# EAGLE design efalcon_V2 (EAGLE 9.5.2)
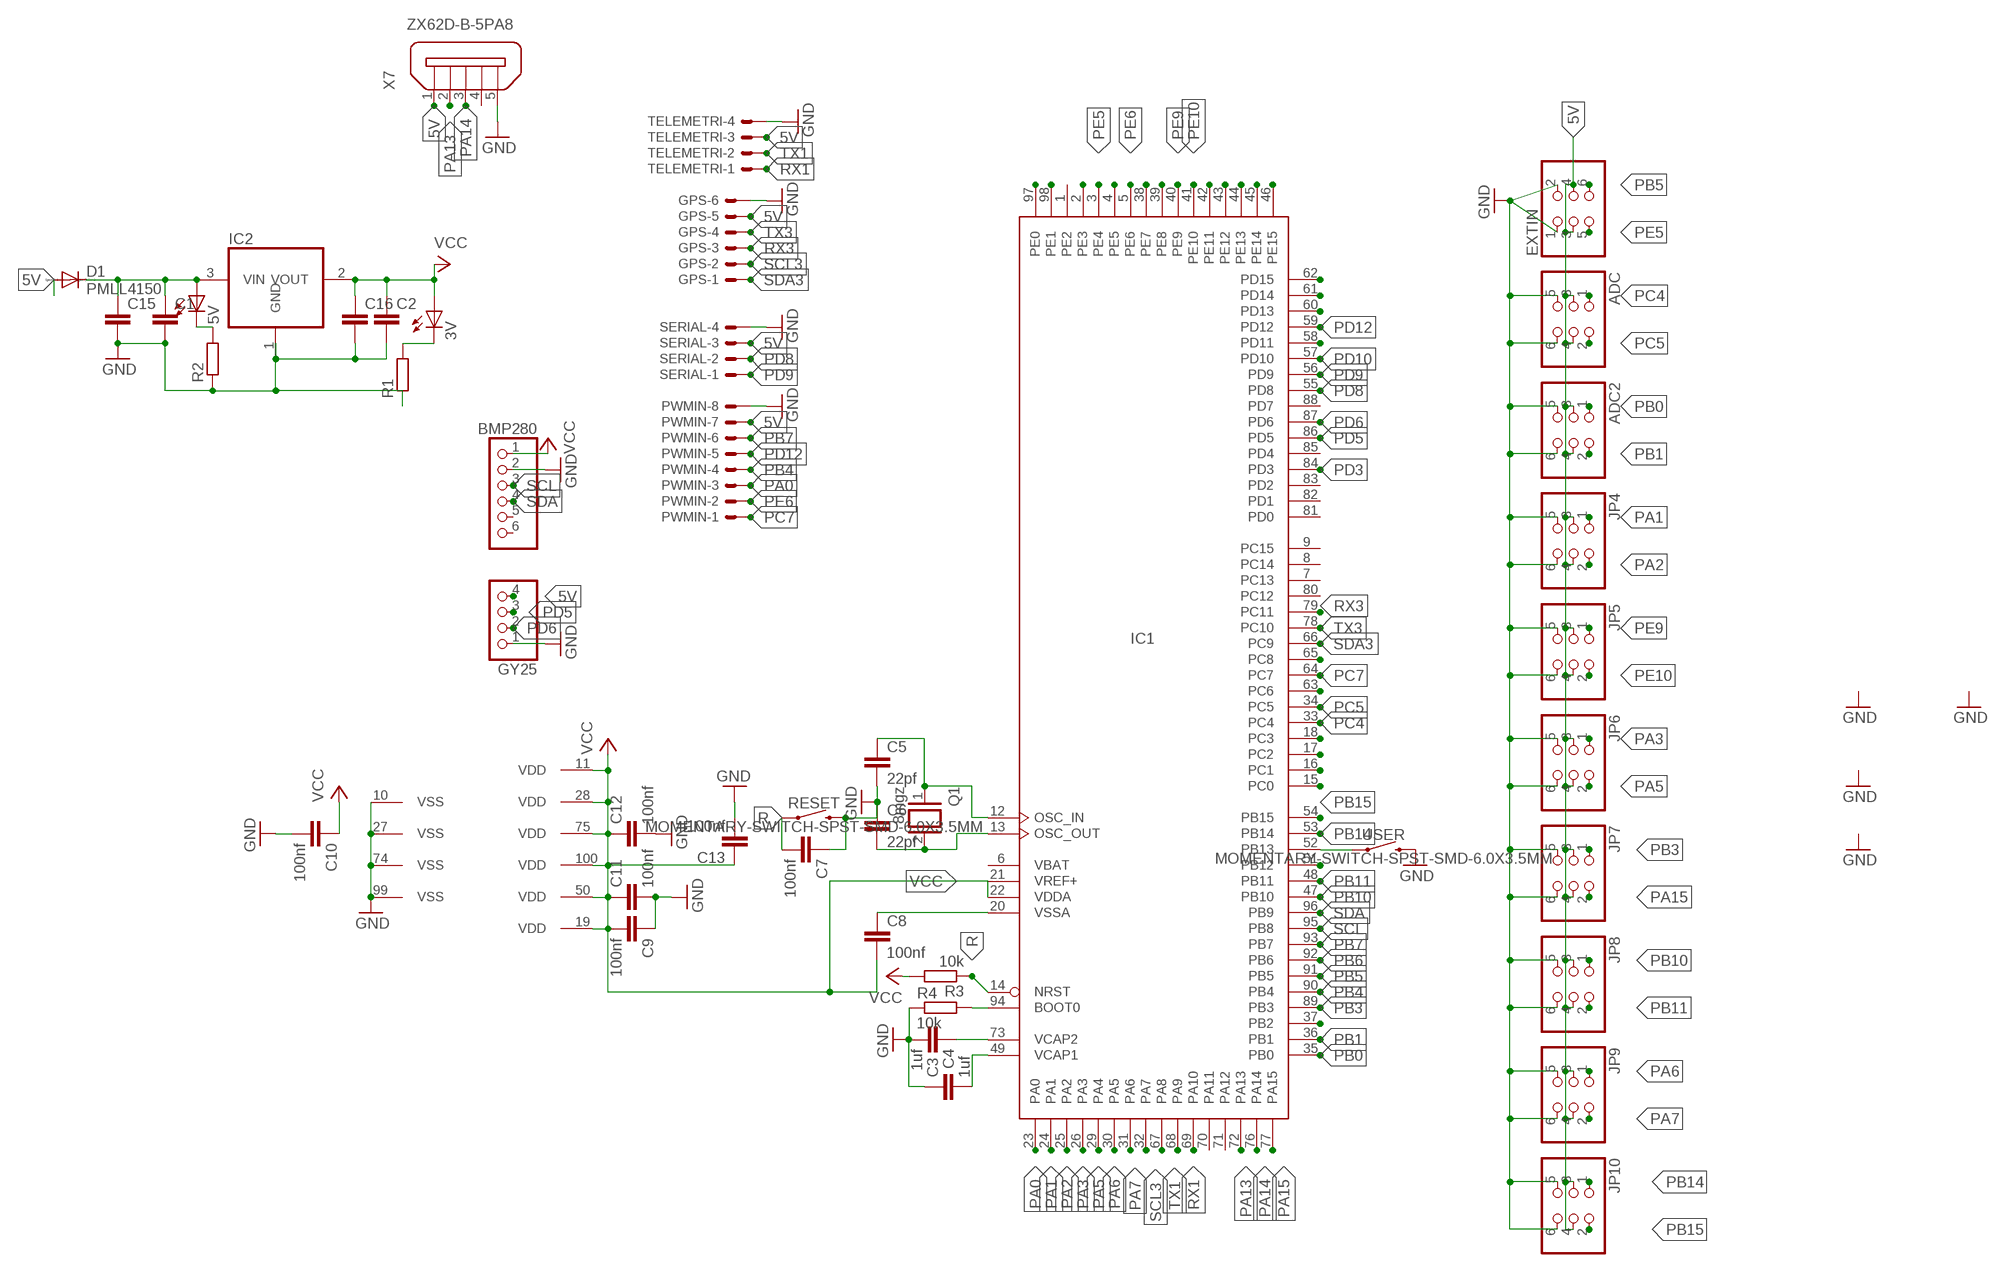
[diagram p0: schematic, sheet 1]

## Parts
3V  LEDCHIP-LED0805  [CHIP-LED0805]
5V  LEDCHIP-LED0805  [CHIP-LED0805]
ADC  PINHD-2X3  [2X03]
ADC2  PINHD-2X3  [2X03]
BMP280  PINHD-1X6  [1X06]
C1  C-EUC0805  [C0805]
C2  C-EUC0805  [C0805]
C3  1uf  C-EUC0805  [C0805]
C4  1uf  C-EUC0805  [C0805]
C5  22pf  C-EUC0805  [C0805]
C6  22pf  C-EUC0805  [C0805]
C7  100nf  C-EUC0805  [C0805]
C8  100nf  C-EUC0805  [C0805]
C9  100nf  C-EUC0805  [C0805]
C10  100nf  C-EUC0805  [C0805]
C11  100nf  C-EUC0805  [C0805]
C12  100nf  C-EUC0805  [C0805]
C13  100nf  C-EUC0805  [C0805]
C15  C-EUC0805  [C0805]
C16  C-EUC0805  [C0805]
D1  PMLL4150  [SOD80C]
EXTIN  PINHD-2X3  [2X03]
GPS  JST-XH-06-PIN-ROUND-PAD  [JST-XH-06-PACKAGE-ROUND-PAD]
GY25  PINHD-1X4  [1X04]
IC1  STM32F407VGT  [LQFP100]
IC2  REG1117  [SOT223]
JP4  PINHD-2X3  [2X03]
JP5  PINHD-2X3  [2X03]
JP6  PINHD-2X3  [2X03]
JP7  PINHD-2X3  [2X03]
JP8  PINHD-2X3  [2X03]
JP9  PINHD-2X3  [2X03]
JP10  PINHD-2X3  [2X03]
PWMIN  JST-XH-08-PIN-ROUND-PAD  [JST-XH-08-PACKAGE-ROUND-PAD]
Q1  8mgz  XTAL/S  [QS]
R1  R-EU_R0805  [R0805]
R2  R-EU_R0805  [R0805]
R3  10k  R-EU_R0805  [R0805]
R4  10k  R-EU_R0805  [R0805]
RESET  MOMENTARY-SWITCH-SPST-SMD-6.0X3.5MM  [TACTILE_SWITCH_SMD_6.0X3.5MM]
SERIAL  JST-XH-04-PIN-ROUND-PAD  [JST-XH-04-PACKAGE-ROUND-PAD]
TELEMETRI  JST-XH-04-PIN-ROUND-PAD  [JST-XH-04-PACKAGE-ROUND-PAD]
USER  MOMENTARY-SWITCH-SPST-SMD-6.0X3.5MM  [TACTILE_SWITCH_SMD_6.0X3.5MM]
X7  ZX62D-B-5PA8  [ZX62D-B-5PA8]

## Nets
5V: ADC2.3 ADC2.4 ADC.3 ADC.4 D1.A EXTIN.3 EXTIN.4 GPS.5 GY25.4 JP4.3 JP4.4 JP5.3 JP5.4 JP6.3 JP6.4 JP7.3 JP7.4 JP8.3 JP8.4 JP9.3 JP9.4 JP10.3 JP10.4 PWMIN.7 SERIAL.3 TELEMETRI.3 X7.1
GND: ADC2.5 ADC2.6 ADC.5 ADC.6 BMP280.2 C1.2 C2.2 C3.1 C4.2 C5.2 C6.1 C7.1 C9.1 C10.2 C11.2 C12.2 C13.2 C15.2 C16.2 EXTIN.1 EXTIN.2 GPS.6 GY25.1 IC1.10(VSS) IC1.27(VSS) IC1.74(VSS) IC1.99(VSS) IC2.1(GND) JP4.5 JP4.6 JP5.5 JP5.6 JP6.5 JP6.6 JP7.5 JP7.6 JP8.5 JP8.6 JP9.5 JP9.6 JP10.5 JP10.6 PWMIN.8 R1.1 R2.1 R4.1 RESET.2 SERIAL.4 TELEMETRI.4 USER.2 X7.5
N$1: IC1.62(PD15)
N$2: 5V.A C1.1 C15.1 D1.C IC2.3(VIN)
N$3: C3.2 IC1.49(VCAP1)
N$7: 5V.C R2.2
N$8: IC1.29(PA4)
N$9: 3V.C R1.2
N$14: IC1.61(PD14)
N$15: IC1.60(PD13)
N$16: C4.1 IC1.73(VCAP2)
N$17: IC1.58(PD11)
N$20: IC1.37(PB2)
N$29: IC1.51(PB12)
N$31: IC1.65(PC8)
N$32: IC1.97(PE0)
N$33: IC1.63(PC6)
N$36: IC1.18(PC3)
N$37: IC1.17(PC2)
N$38: IC1.16(PC1)
N$39: IC1.15(PC0)
N$40: IC1.98(PE1)
N$42: IC1.2(PE3)
N$44: IC1.3(PE4)
N$46: IC1.38(PE7)
N$47: IC1.39(PE8)
N$48: IC1.42(PE11)
N$49: IC1.43(PE12)
N$50: IC1.45(PE14)
N$51: IC1.44(PE13)
N$52: IC1.46(PE15)
N$53: IC1.94(BOOT0) R4.2
N$54: C5.1 IC1.12(OSC_IN) Q1.1
N$55: C6.2 IC1.13(OSC_OUT) Q1.2
N$57: C8.1 IC1.20(VSSA)
N$80: IC1.52(PB13) USER.1
PA0: IC1.23(PA0) PWMIN.3
PA1: IC1.24(PA1) JP4.1
PA2: IC1.25(PA2) JP4.2
PA3: IC1.26(PA3) JP6.1
PA5: IC1.30(PA5) JP6.2
PA6: IC1.31(PA6) JP9.1
PA7: IC1.32(PA7) JP9.2
PA13: IC1.72(PA13) X7.2
PA14: IC1.76(PA14) X7.3
PA15: IC1.77(PA15) JP7.2
PB0: ADC2.1 IC1.35(PB0)
PB1: ADC2.2 IC1.36(PB1)
PB3: IC1.89(PB3) JP7.1
PB4: IC1.90(PB4) PWMIN.4
PB5: EXTIN.6 IC1.91(PB5)
PB6: IC1.92(PB6)
PB7: IC1.93(PB7) PWMIN.6
PB10: IC1.47(PB10) JP8.1
PB11: IC1.48(PB11) JP8.2
PB14: IC1.53(PB14) JP10.1
PB15: IC1.54(PB15) JP10.2
PC4: ADC.1 IC1.33(PC4)
PC5: ADC.2 IC1.34(PC5)
PC7: IC1.64(PC7) PWMIN.1
PD3: IC1.84(PD3)
PD5: GY25.3 IC1.86(PD5)
PD6: GY25.2 IC1.87(PD6)
PD8: IC1.55(PD8) SERIAL.2
PD9: IC1.56(PD9) SERIAL.1
PD10: IC1.57(PD10)
PD12: IC1.59(PD12) PWMIN.5
PE5: EXTIN.5 IC1.4(PE5)
PE6: IC1.5(PE6) PWMIN.2
PE9: IC1.40(PE9) JP5.1
PE10: IC1.41(PE10) JP5.2
R: C7.2 IC1.14(NRST) R3.1 RESET.1
RX1: IC1.69(PA10) TELEMETRI.1
RX3: GPS.3 IC1.79(PC11)
SCL: BMP280.3 IC1.95(PB8)
SCL3: GPS.2 IC1.67(PA8)
SDA: BMP280.4 IC1.96(PB9)
SDA3: GPS.1 IC1.66(PC9)
TX1: IC1.68(PA9) TELEMETRI.2
TX3: GPS.4 IC1.78(PC10)
VCC: 3V.A BMP280.1 C2.1 C8.2 C9.2 C10.1 C11.1 C12.1 C13.1 C16.1 IC1.11(VDD) IC1.19(VDD) IC1.21(VREF+) IC1.22(VDDA) IC1.28(VDD) IC1.50(VDD) IC1.75(VDD) IC1.100(VDD) IC2.2(VOUT) R3.2
Unconnected: BMP280.5 BMP280.6 IC1.1(PE2) IC1.7(PC13) IC1.8(PC14) IC1.9(PC15) IC1.70(PA11) IC1.71(PA12) IC1.80(PC12) IC1.81(PD0) IC1.82(PD1) IC1.83(PD2) IC1.85(PD4) IC1.88(PD7) X7.4 X7.S1 X7.S2 X7.S3 X7.S4

## Power pins joined to a net without a drawn wire
VBAT: IC1.6(VBAT)

## Library data of the parts
3V 5V = led:LED: LED OSRAM: - CHIPLED LG R971, LG N971, LY N971, LG Q971, LY Q971, LO R971, LY R971 LH N974, LH R974 LS Q976, LO Q976, LY Q976 LO Q996 - Hyper CHIPLED LW Q18S LB Q993, LB Q99A, LB R99A - SideLED LS A670, LO A670, LY A670, LG A670, LP A670 LB A673, LV A673, LT A673, LW A673 LH A674 LY A675 LS A676, LA A676, LO A676, LY A676, LW A676 LS A679, LY A679, LG A679 - Hyper Micro SIDELED® LS Y876, LA Y876, LO Y876, LY Y876 LT Y87S - SmartLED LW L88C, LW L88S LB L89C, LB L89S, LG L890 LS L89K, LO L89K, LY L89K LS L896, LA L896, LO L896, LY L896 - TOPLED LS T670, LO T670, LY T670, LG T670, LP T670 LSG T670, LSP T670, LSY T670, LOP T670, LYG T670 LG T671, LOG T671, LSG T671 LB T673, LV T673, LT T673, LW T673 LH T674 LS T676, LA T676, LO T676, LY T676, LB T676, LH T676, LSB T676, LW T676 LB T67C, LV T67C, LT T67C, LS T67K, LO T67K, LY T67K, LW E67C LS E67B, LA E67B, LO E67B, LY E67B, LB E67C, LV E67C, LT E67C LW T67C LS T679, LY T679, LG T679 LS T770, LO T770, LY T770, LG T770, LP T770 LB T773, LV T773, LT T773, LW T773 LH T774 LS E675, LA E675, LY E675, LS T675 LS T776, LA T776, LO T776, LY T776, LB T776 LHGB T686 LT T68C, LB T68C - Hyper Mini TOPLED® LB M676 - Mini TOPLED Santana® LG M470 LS M47K, LO M47K, LY M47K Source: http://www.osram.convergy.de LUXEON: - LUMILED® LXK2-PW12-R00, LXK2-PW12-S00, LXK2-PW14-U00, LXK2-PW14-V00 LXK2-PM12-R00, LXK2-PM12-S00, LXK2-PM14-U00 LXK2-PE12-Q00, LXK2-PE12-R00, LXK2-PE12-S00, LXK2-PE14-T00, LXK2-PE14-U00 LXK2-PB12-K00, LXK2-PB12-L00, LXK2-PB12-M00, LXK2-PB14-N00, LXK2-PB14-P00, LXK2-PB14-Q00 LXK2-PR12-L00, LXK2-PR12-M00, LXK2-PR14-Q00, LXK2-PR14-R00 LXK2-PD12-Q00, LXK2-PD12-R00, LXK2-PD12-S00 LXK2-PH12-R00, LXK2-PH12-S00 LXK2-PL12-P00, LXK2-PL12-Q00, LXK2-PL12-R00 Source: www.luxeon.com KINGBRIGHT: KA-3528ASYC Source: www.kingbright.com
ADC ADC2 EXTIN JP4-JP10 = pinhead:PINHD-2X3: PIN HEADER
BMP280 = pinhead:PINHD-1X6: PIN HEADER
C1-C13 C15 C16 = resistor:C-EU: CAPACITOR, European symbol
D1 = diode:PMLL4150: DIODE high speed
GPS = JST XH Connectors v1-0:JST-XH-06-PIN: JST XH Connector 2 Pin Wire to board connector. Pitch: 2,54 mm, (0.100") Number of pins: 6 Created by Rembrandt Electronics www.rembrandtelectronics.com
GY25 = pinhead:PINHD-1X4: PIN HEADER
IC1 = micro-stm:STM32F407V*T: ARM 32-bit Cortex™-M3 CPU 168 MHz maximum frequency 512 to 1024 Kbytes of Flash memory 192 kbytes of SRAM 82 GPIOs 1.8 to 3.6 V application supply
IC2 = burr-brown:REG1117: 800mA and 1A Low Dropout (LDO) Positive Regulator 1.8V, 2.5V, 2.85V, 3.3V, 5V, and Adj; MPN: REG1117; OC_FARNELL: 1097566; OC_NEWARK: 14P6981
PWMIN = JST XH Connectors v1-0:JST-XH-08-PIN: JST XH Connector 2 Pin Wire to board connector. Pitch: 2,54 mm, (0.100") Number of pins: 8 Created by Rembrandt Electronics www.rembrandtelectronics.com
Q1 = special:XTAL/S: CRYSTAL
R1-R4 = resistor:R-EU_: RESISTOR, European symbol
RESET USER = SparkFun-Switches:MOMENTARY-SWITCH-SPST: Momentary Switch (Pushbutton) - SPST Normally-open (NO) SPST momentary switches (buttons, pushbuttons). Variants PTH-12MM - 12mm square, through-hole Momentary Pushbutton Switch - 12mm Square <https://www.sparkfun.com/products/9190> (COM-09190) PTH-6.0MM, PTH-6.0MM-KIT - 6.0mm square, through-hole Mini Pushbutton Switch <https://www.sparkfun.com/products/97> (COM-00097) KIT package intended for soldering kit's - only one side of pads' copper is exposed. PTH-RIGHT-ANGLE-KIT - Right-angle, through-hole Right Angle Tactile Button <https://www.sparkfun.com/products/10791> - Used on SparkFun BigTime Watch Kit <https://www.sparkfun.com/products/11734> SMD-12MM - 12mm square, surface-mount Tactile Button - SMD (12mm) <https://www.sparkfun.com/products/12993> (COM-12993) Used on SparkFun PicoBoard <https://www.sparkfun.com/products/11888> SMD-4.5MM - 4.5mm Square Trackball Switch Used on SparkFun Blackberry Trackballer Breakout <https://www.sparkfun.com/products/13169> SMD-4.6MMX2.8MM - 4.60mm x 2.80mm, surface mount Used on SparkFun SAMD21 Mini Breakout <https://www.sparkfun.com/products/13664> SMD-5.2MM, SMD-5.2-REDUNDANT - 5.2mm square, surface-mount Mini Pushbutton Switch - SMD <https://www.sparkfun.com/products/8720> (COM-08720) Used on Arduino Pro Mini <https://www.sparkfun.com/products/11114> REDUNDANT package connects both switch circuits together SMD-6.0X3.5MM - 6.0 x 3.5mm, surface mount Momentary Reset Switch SMD <https://www.sparkfun.com/products/8229> (COM-08229) SMD-6.2MM-TALL - 6.2mm square, surface mount Tactile Button - SMD (6mm) <https://www.sparkfun.com/products/12992> Used on SparkFun Digital Sandbox <https://www.sparkfun.com/products/12651> SMD-RIGHT-ANGLE - Right-angle, surface mount Used on SparkFun Block for Intel® Edison - Arduino <https://www.sparkfun.com/products/13036>; PROD_ID: SWCH-14278; SF_SKU: COM-08229
SERIAL TELEMETRI = JST XH Connectors v1-0:JST-XH-04-PIN: JST XH Connector 2 Pin Wire to board connector. Pitch: 2,54 mm, (0.100") Number of pins: 4 Created by Rembrandt Electronics www.rembrandtelectronics.com
X7 = usb b:ZX62D-B-5PA8: Micro USB Type B Connector - Standard, Shell Through Hole Source: http://www.hirose.co.jp/cataloge_hp/ed_ZX_20140804.pdf; MF: Hirose; MPN: ZX62D-B-5PA8; OC_FARNELL: 2300438; OC_NEWARK: 69W0712

## Board
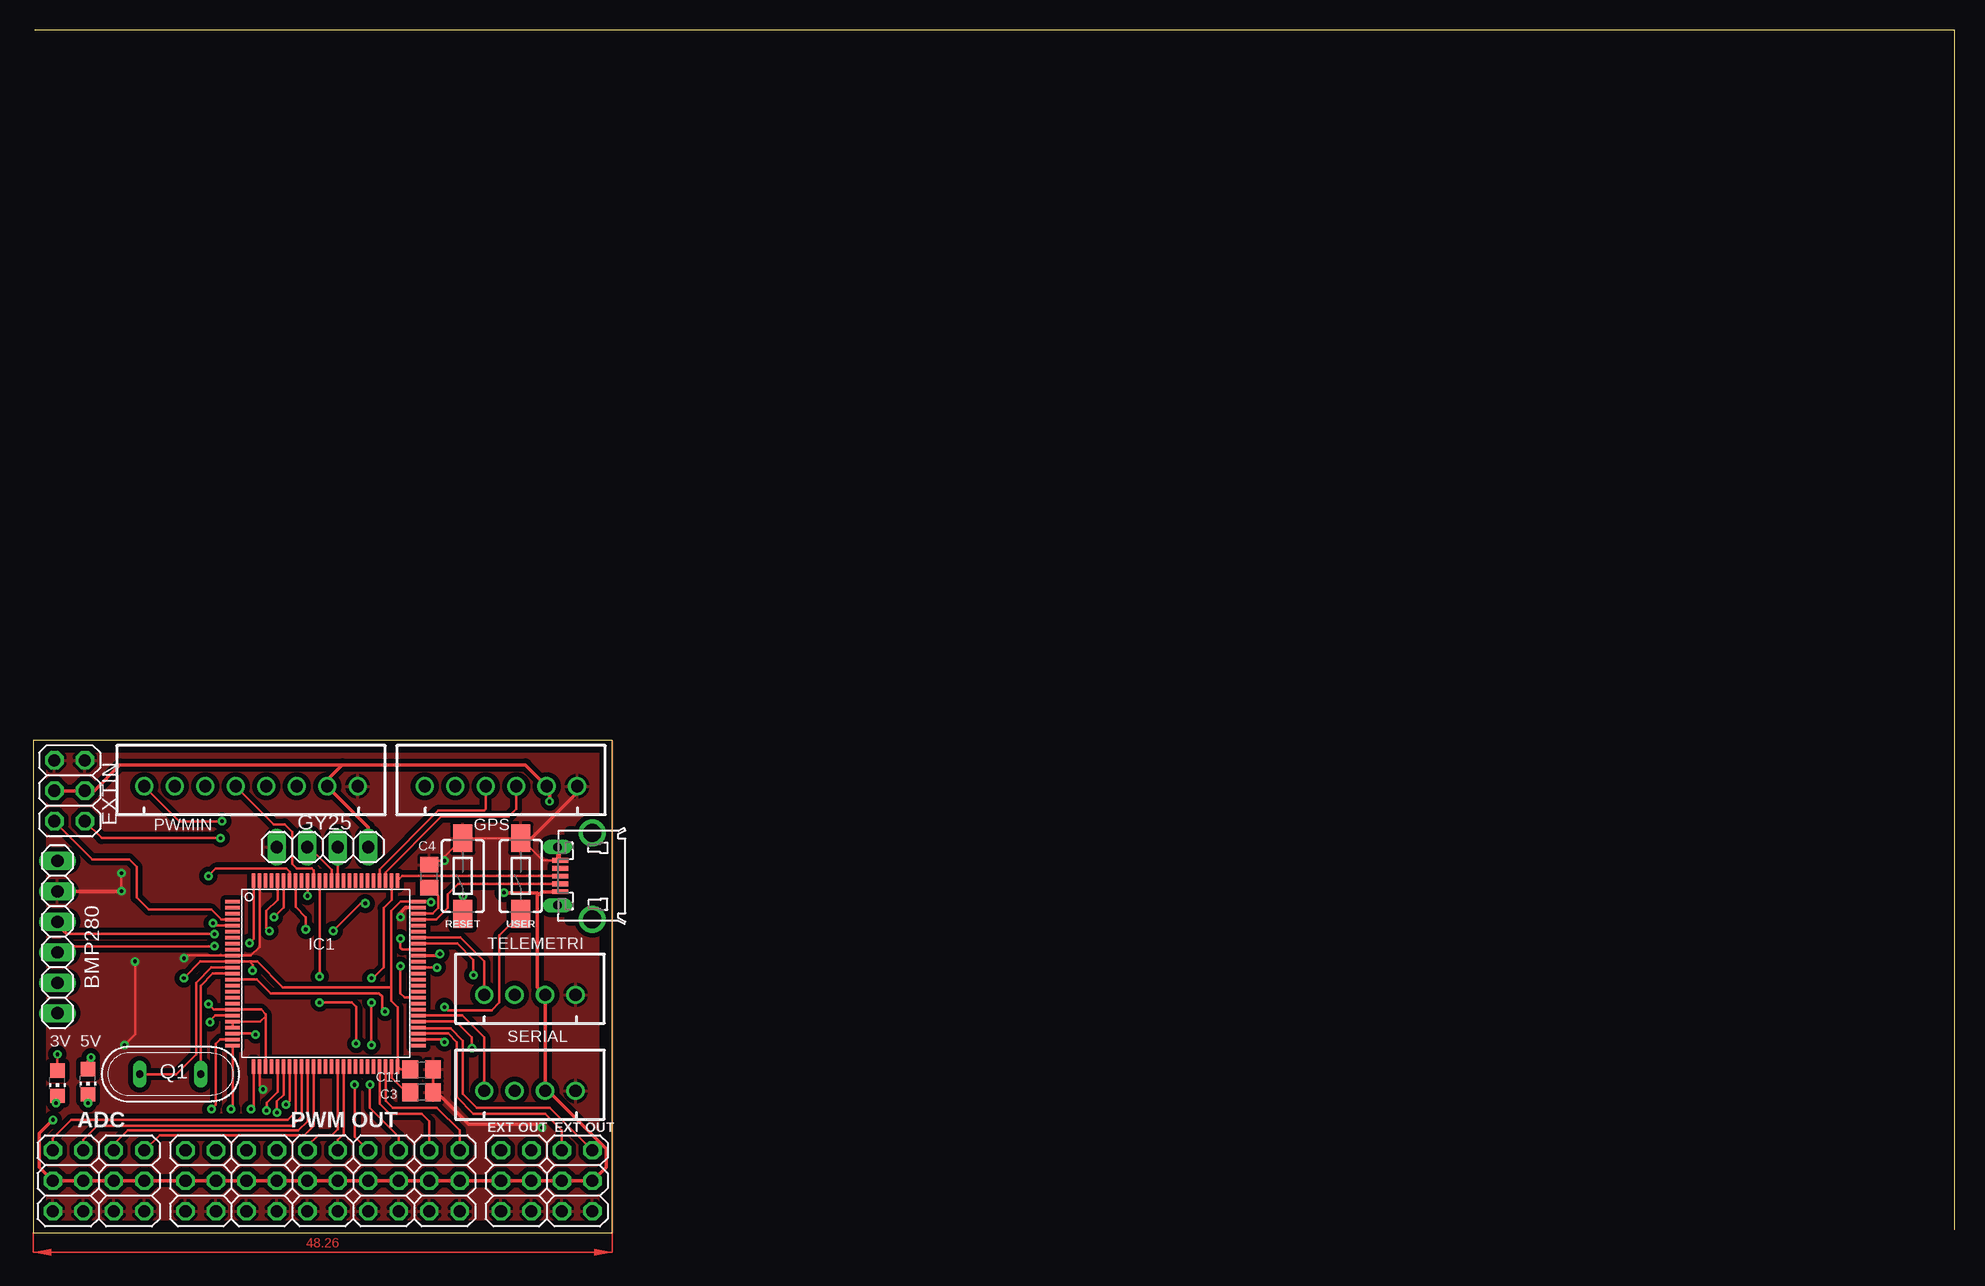
[diagram p1: board, top side]
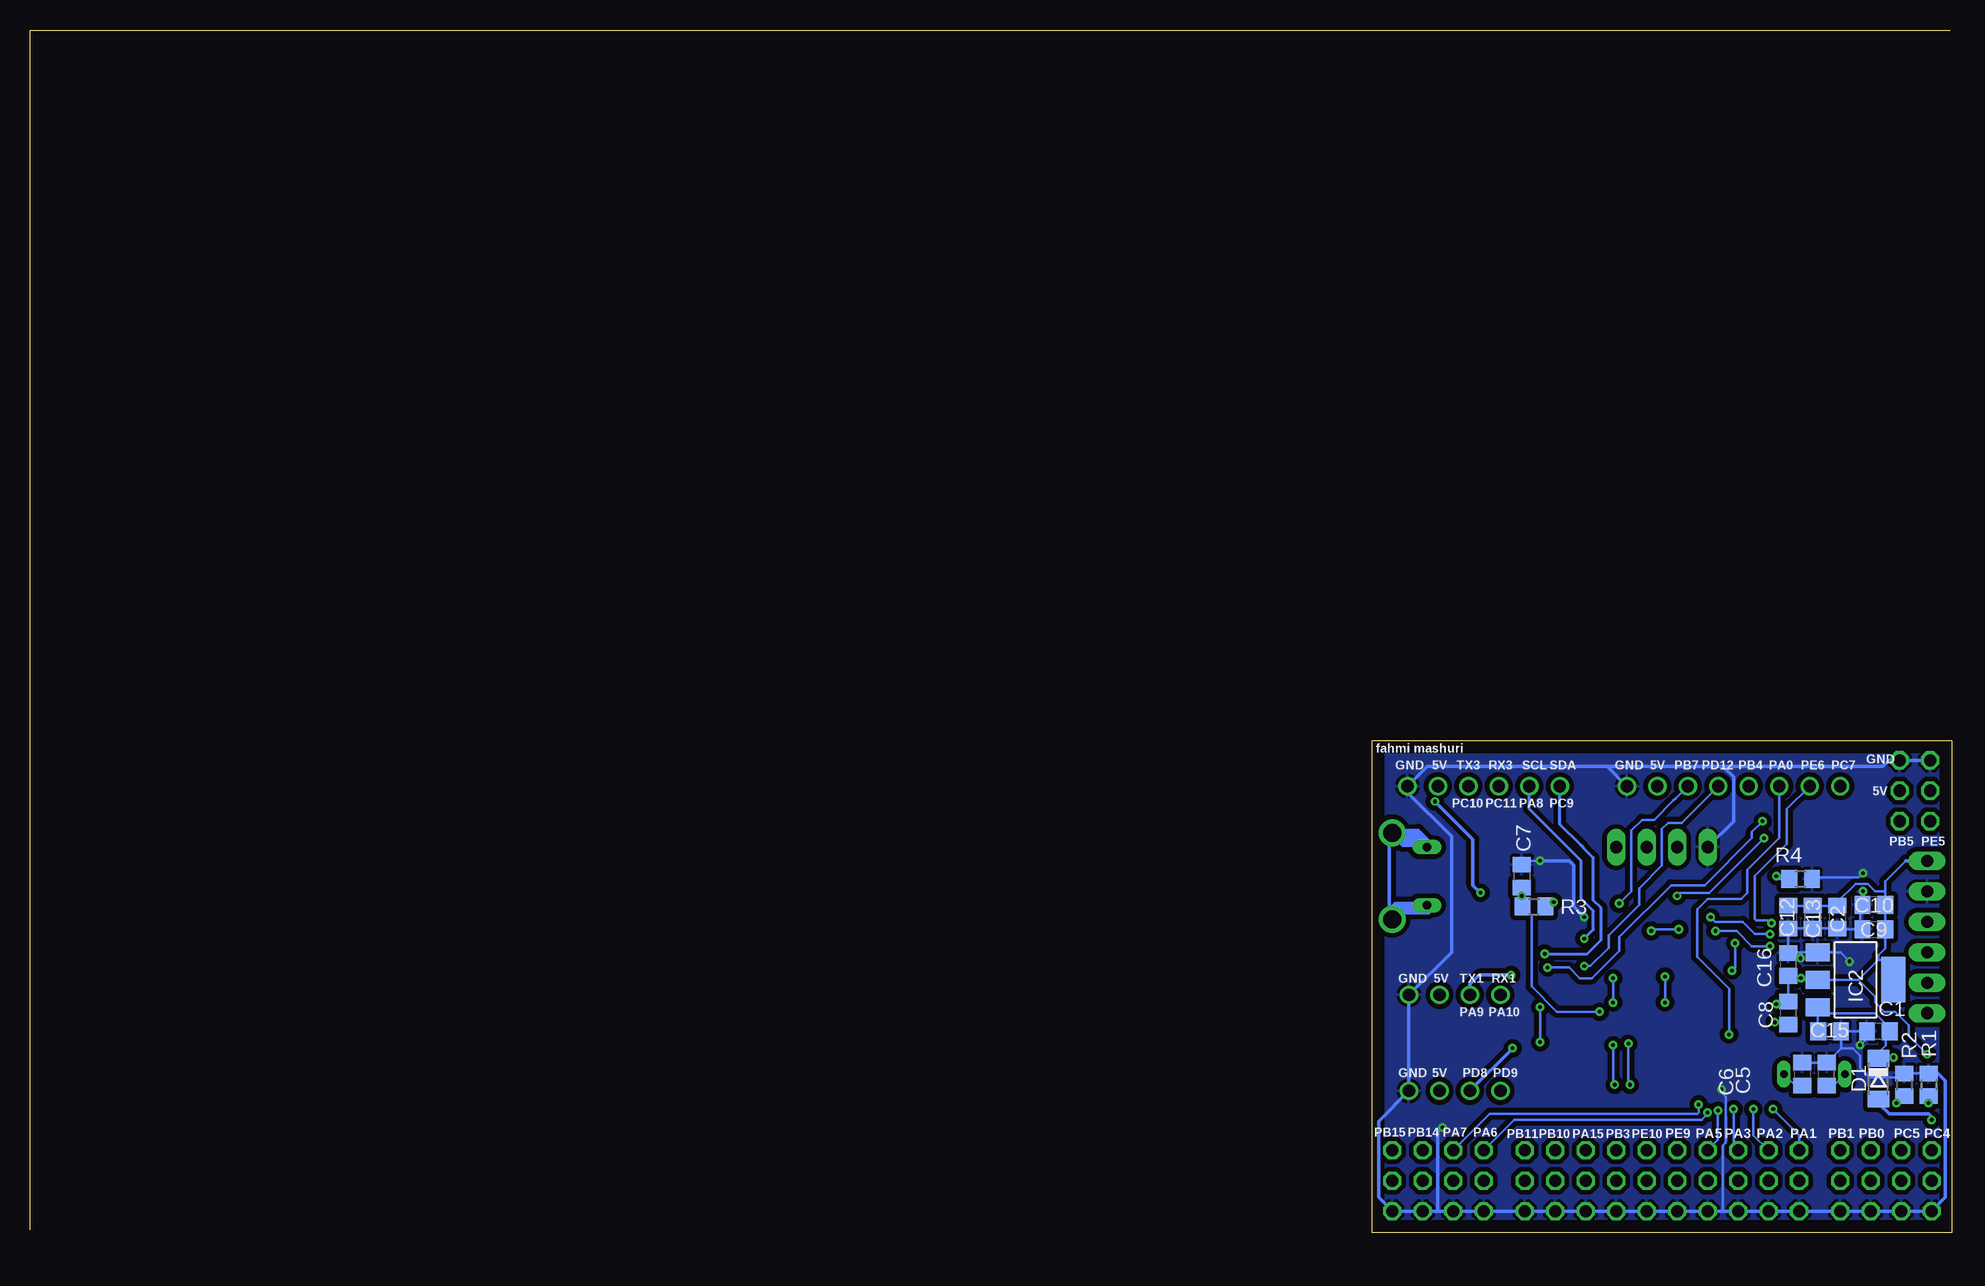
[diagram p2: board, bottom side, seen from below]

Size 160.13 x 100.25 mm. Coordinates in mm from the lower left corner, seen from the top.
Outline: 160.13,0.25 160.13,100.25 0.13,100.25
Outline: 48.26,0 48.26,41.02 0,41.02 0,0 48.26,0
Copper layers (1*16): Top 0.035mm / dielectric 1.5mm / Bottom 0.035mm
Design rules "default *": minimum track width 6mil, minimum drill 0.3mm, track to track 6mil, track to pad 6mil, pad to pad 6mil, via to via 6mil, smd to smd 6mil, copper to edge 40mil, drill to drill 6mil, minimum pad ring 10mil, minimum via ring 8mil, stop-mask expansion 4mil, vias tented up to drill 0mil, thermal gap 10mil

### Footprints (pad centres in the part's own frame; a part is rotated, then mirrored left to right if it is on the bottom)
CHIP-LED0805 = smd 1.2 x 1.2: A 0,-1.05; C 0,1.05
2X03 = drill 1.016 octagon: 1 -2.54,-1.27; 2 -2.54,1.27; 3 0,-1.27; 4 0,1.27; 5 2.54,-1.27; 6 2.54,1.27
1X06 = drill 1.016 long: 1 -6.35,0; 2 -3.81,0; 3 -1.27,0; 4 1.27,0; 5 3.81,0; 6 6.35,0
C0805 = smd 1.3 x 1.5: 1 -0.95,0; 2 0.95,0
SOD80C = smd 1.4 x 1.8: A 1.7,0; C -1.7,0
JST-XH-06-PACKAGE-ROUND-PAD = drill 1.016: 1 -6.35,0; 2 -3.81,0; 3 -1.27,0; 4 1.27,0; 5 3.81,0; 6 6.35,0
1X04 = drill 1.016 long: 1 -3.81,0; 2 -1.27,0; 3 1.27,0; 4 3.81,0
LQFP100 = smd 0.3 x 1.2: 1 -6,-7.75; 2 -5.5,-7.75; 3 -5,-7.75; 4 -4.5,-7.75; 5 -4,-7.75; 6 -3.5,-7.75; 7 -3,-7.75; 8 -2.5,-7.75; 9 -2,-7.75; 10 -1.5,-7.75; 11 -1,-7.75; 12 -0.5,-7.75; 13 0,-7.75; 14 0.5,-7.75; 15 1,-7.75; 16 1.5,-7.75; 17 2,-7.75; 18 2.5,-7.75; 19 3,-7.75; 20 3.5,-7.75; 21 4,-7.75; 22 4.5,-7.75; 23 5,-7.75; 24 5.5,-7.75; 25 6,-7.75; 51 6,7.75; 52 5.5,7.75; 53 5,7.75; 54 4.5,7.75; 55 4,7.75; 56 3.5,7.75; 57 3,7.75; 58 2.5,7.75; 59 2,7.75; 60 1.5,7.75; 61 1,7.75; 62 0.5,7.75; 63 0,7.75; 64 -0.5,7.75; 65 -1,7.75; 66 -1.5,7.75; 67 -2,7.75; 68 -2.5,7.75; 69 -3,7.75; 70 -3.5,7.75; 71 -4,7.75; 72 -4.5,7.75; 73 -5,7.75; 74 -5.5,7.75; 75 -6,7.75 | smd 1.2 x 0.3: 26 7.75,-6; 27 7.75,-5.5; 28 7.75,-5; 29 7.75,-4.5; 30 7.75,-4; 31 7.75,-3.5; 32 7.75,-3; 33 7.75,-2.5; 34 7.75,-2; 35 7.75,-1.5; 36 7.75,-1; 37 7.75,-0.5; 38 7.75,0; 39 7.75,0.5; 40 7.75,1; 41 7.75,1.5; 42 7.75,2; 43 7.75,2.5; 44 7.75,3; 45 7.75,3.5; 46 7.75,4; 47 7.75,4.5; 48 7.75,5; 49 7.75,5.5; 50 7.75,6; 76 -7.75,6; 77 -7.75,5.5; 78 -7.75,5; 79 -7.75,4.5; 80 -7.75,4; 81 -7.75,3.5; 82 -7.75,3; 83 -7.75,2.5; 84 -7.75,2; 85 -7.75,1.5; 86 -7.75,1; 87 -7.75,0.5; 88 -7.75,0; 89 -7.75,-0.5; 90 -7.75,-1; 91 -7.75,-1.5; 92 -7.75,-2; 93 -7.75,-2.5; 94 -7.75,-3; 95 -7.75,-3.5; 96 -7.75,-4; 97 -7.75,-4.5; 98 -7.75,-5; 99 -7.75,-5.5; 100 -7.75,-6
SOT223 = smd 1.499 x 2.007: 1 -2.261,-3.15; 2 0.025,-3.15; 3 2.311,-3.15 | smd 3.81 x 2.007: 4 0,3.15
JST-XH-08-PACKAGE-ROUND-PAD = drill 1.016: 1 -8.89,0; 2 -6.35,0; 3 -3.81,0; 4 -1.27,0; 5 1.27,0; 6 3.81,0; 7 6.35,0; 8 8.89,0
QS = drill 0.61 long: 1 -2.54,0; 2 2.54,0
R0805 = smd 1.3 x 1.5: 1 -0.95,0; 2 0.95,0
TACTILE_SWITCH_SMD_6.0X3.5MM = smd 2.3 x 1.6: 1 -3.15,0; 2 3.15,0
JST-XH-04-PACKAGE-ROUND-PAD = drill 1.016: 1 -3.81,0; 2 -1.27,0; 3 1.27,0; 4 3.81,0
ZX62D-B-5PA8 = smd 1.35 x 0.4: 1 4.825,1.3; 2 4.825,0.65; 3 4.825,0; 4 4.825,-0.65; 5 4.825,-1.3 | drill 1.5: S1 2.15,-3.6; S2 2.15,3.6 | drill 0.7 long: S3 5.05,2.425; S4 5.05,-2.425

### Placement (x,y rotation side)
3V  2.03,12.45 180 top
5V  4.57,12.57 180 top
ADC  2.92,4.32 270 top
ADC2  8,4.32 270 top
BMP280  2.03,24.64 270 top
C1  6.1,16.76 180 bottom
C2  9.53,26.29 270 bottom
C3  32.39,11.68 180 top
C4  33.02,29.72 90 top
C5  10.41,13.21 90 bottom
C6  12.45,13.21 270 bottom
C7  35.81,29.72 270 bottom
C8  13.59,18.29 90 bottom
C9  6.48,25.27 0 bottom
C10  6.48,27.3 180 bottom
C11  32.39,13.59 0 top
C12  13.59,26.29 270 bottom
C13  11.56,26.29 270 bottom
C15  10.16,16.76 0 bottom
C16  13.59,22.35 90 bottom
D1  6.1,12.83 270 bottom
EXTIN  3.05,36.83 270 top
GPS  38.99,37.21 0 top
GY25  24.13,32.13 0 top
IC1  24.38,21.59 270 top
IC2  8,21.08 270 bottom
JP4  13.97,4.32 270 top
JP5  24.13,4.32 270 top
JP6  19.05,4.32 270 top
JP7  29.21,4.32 270 top
JP8  34.29,4.32 270 top
JP9  40.26,4.32 270 top
JP10  45.34,4.32 270 top
PWMIN  18.16,37.21 0 top
Q1  11.43,13.21 0 top
R1  1.91,12.32 270 bottom
R2  3.94,12.32 270 bottom
R3  34.8,27.18 0 bottom
R4  12.57,29.46 180 bottom
RESET  35.81,29.72 90 top
SERIAL  41.4,11.81 0 top
TELEMETRI  41.4,19.81 0 top
USER  40.64,29.72 90 top
X7  48.77,29.72 180 top

### Tracks (layer width: path | path; a pad name or v marks a point on that pad's centre or on a via)
5V  (via drill 0.3)
  Top 0.3: v1.65,9.4 0.51,8.25 0.51,5.46 ADC.3 ADC.4 ADC2.3 ADC2.4 JP4.3 JP4.4 JP6.3 JP6.4 JP5.3 JP5.4 JP7.3 JP7.4 JP8.3 JP8.4 JP9.3 JP9.4 JP10.3 JP10.4 47.75,5.46 47.75,6.98 42.93,11.81 SERIAL.3 TELEMETRI.3 42.04,20.45 42.04,28.07 42.16,28.19 | X7.1 42.39,28.42 42.16,28.19 | 42.16,28.19 42.04,28.32 v39.24,28.32 | v43.05,35.94 43.05,36.96 GPS.5 41.02,38.99 25.78,38.99 | GY25.4 27.94,33.78 PWMIN.7 24.51,37.72 25.78,38.99 | EXTIN.3 EXTIN.4 5.08,36.83 7.24,38.99 25.78,38.99
  Bottom 0.3: D1.A 6.1,10.79 5.21,9.91 1.91,9.91 1.65,9.65 v1.65,9.4 | v39.24,28.32 39.88,28.96 39.88,32.77 v43.05,35.94
GND  (via drill 0.3)
  Top 0.2: C11.2 C3.1 | C4.2 33.34,30.99 v34.29,30.99 34.29,31.34 RESET.2 USER.2 42.49,31.02 X7.5 | v12.57,22.86 12.8,23.09 IC1.10 16.66,23.11 18.16,23.11 18.88,23.84 IC1.99 | IC1.27 18.88,12.23 v19.18,11.94 | v7.37,29.97 v7.37,28.45 | v8.51,22.61 8.51,16.51 v7.62,15.62
  Top 0.3: C3.1 33.66,11.68 36.32,9.02 42.16,9.02 v42.42,8.76 | IC1.74 31.03,27.09 30.61,26.67 v30.61,26.29 | USER.2 41.53,32.87 45.34,36.68 GPS.6 | BMP280.2 v7.37,28.45
  Bottom 0.2: v34.29,30.99 35.49,30.99 C7.1 | C6.1 C5.2 9.21,15.36 | C1.2 7.11,16.76 | 7.11,16.76 C15.2 9.21,15.36 | C9.1 7.62,25.27 | 7.62,25.27 9.46,25.27 C2.2 C13.2 C12.2 C16.2 | 7.62,25.27 7.62,27.11 C10.2 7.37,27.37 v7.37,28.45 | R1.1 R2.1 4.26,13.27 4.57,12.95 6.86,12.95 7.62,13.72 7.62,14.73 8.25,15.36 9.21,15.36 | C16.2 13.55,23.34 IC2.1 9.25,23.34 v8.51,22.61 | C16.2 13.59,22.86 v12.57,22.86 | v19.18,11.94 19.18,11.68 18.8,11.3 18.8,7.49 19.05,7.24 19.05,1.78 | R4.1 11.5,29.59 7.75,29.59 v7.37,29.97 | v7.62,15.62 7.11,16.13 7.11,16.76
  Bottom 0.3: R1.1 1.14,13.27 0.51,12.63 0.51,2.92 ADC.5 ADC.6 ADC2.5 ADC2.6 JP4.5 JP4.6 JP6.5 19.05,1.78 JP6.6 JP5.5 JP5.6 JP7.5 JP7.6 JP8.5 JP8.6 JP9.5 JP9.6 42.67,1.78 | 42.67,1.78 JP10.5 JP10.6 47.75,2.92 47.75,9.27 SERIAL.4 TELEMETRI.4 41.66,23.37 41.66,33.02 45.34,36.7 GPS.6 43.69,38.86 28.7,38.86 | v42.42,8.76 42.8,8.38 42.8,1.91 42.67,1.78 | v30.61,26.29 31.5,27.18 31.5,30.61 31.88,30.99 v34.29,30.99 | PWMIN.8 28.7,38.86 | GY25.1 18.16,34.29 18.16,37.97 19.05,38.86 | 19.05,38.86 28.7,38.86 | EXTIN.1 EXTIN.2 5.21,39.37 5.71,38.86 19.05,38.86
  pour Bottom (isolate 0.4): 0.13,0.25 48.13,0.25 48.13,40.89 0.13,40.89
  pour Top (isolate 0.4): 0.13,0.25 48.13,0.25 48.13,40.89 0.13,40.89
N$2  (via drill 0.3)
  Top 0.2: v4.83,14.61 4.57,14.35 5V.A
  Bottom 0.2: C15.1 11.15,16.8 IC2.3 10.67,18.29 6.35,18.29 5.15,17.08 C1.1 5.46,16.45 5.46,15.62 6.1,14.99 6.1,14.61 | 6.1,14.61 D1.C | v4.83,14.61 6.1,14.61
N$3
  Top 0.2: IC1.49 29.88,12.91 31.11,11.68 C3.2
N$4
  Bottom 0.2: 6.1,22.86 5.97,22.73 5.33,22.73
N$5
  Bottom 0.3: 46.86,33.4 45.72,32.26 43.18,32.26 43.43,32.51 | 43.43,32.51 44.45,33.53 46.99,33.53 46.86,33.4 | 43.43,32.51 45.72,32.51 45.85,32.64 45.72,32.77 43.94,32.77 44.2,33.02 46.23,33.02 46.48,33.27 44.45,33.27 | 46.86,33.4 46.86,26.67
N$6
  Bottom 0.3: 43.18,27.18 43.31,27.18 | 43.31,27.18 46.48,27.18 47.37,26.29 | 43.31,27.18 43.31,27.3 43.56,27.56 43.69,27.43 46.36,27.43 47.37,26.42 47.37,26.16 47.24,26.04 46.36,26.92 43.31,26.92 | 43.31,26.92 43.18,27.05 | 43.31,26.92 43.56,26.67 46.36,26.67 47.24,25.78
N$7  (via drill 0.3)
  Top 0.2: v4.57,10.79 5V.C
  Bottom 0.2: R2.2 4.51,10.79 v4.57,10.79
N$9  (via drill 0.3)
  Top 0.2: v1.91,10.79 2.03,10.92 3V.C
  Bottom 0.2: R1.2 v1.91,10.79
N$10
  Top 0.4: 43.82,31.12 43.82,32.13
N$16
  Top 0.2: C4.1 33.78,28.01 33.78,27.05 33.32,26.59 IC1.73
N$53  (via drill 0.3)
  Top 0.2: IC1.94 21.38,30.05 21.08,30.35 15.24,30.35 v14.61,29.72
  Bottom 0.2: v14.61,29.72 14.35,29.46 R4.2
N$54
  Top 0.2: IC1.12 14.85,22.09 13.59,20.83 13.59,14.86 11.94,13.21 Q1.1
  Bottom 0.2: Q1.1 10.16,11.94 10.41,12.19 C5.1
N$55
  Top 0.2: IC1.13 14.99,21.59 13.97,20.57 Q1.2
  Bottom 0.2: Q1.2 12.7,11.94 12.45,12.19 C6.2
N$57  (via drill 0.3)
  Top 0.2: IC1.20 15.17,18.09 14.73,17.65 v14.73,17.53
  Bottom 0.2: v14.73,17.53 13.78,17.53 C8.1
N$80  (via drill 0.3)
  Top 0.2: IC1.52 34.08,16.09 v34.29,15.88 | v34.29,18.8 34.54,18.54 38.23,18.54 38.86,19.18 38.86,24.79 USER.1
  Bottom 0.2: v34.29,15.88 v34.29,18.8
PA0  (via drill 0.3)
  Top 0.2: v18.54,16.51 18.46,16.59 IC1.23
  Bottom 0.2: v18.54,16.51 18.54,20.32 21.21,22.99 21.21,26.92 20.32,27.81 17.53,27.81 17.02,28.32 17.02,30.23 14.35,32.89 PWMIN.3
PA1  (via drill 0.3)
  Top 0.2: IC1.24 15.58,16.09 15.24,15.75 15.24,10.67 v14.86,10.29
  Bottom 0.2: v14.86,10.29 12.7,8.13 JP4.1
PA2  (via drill 0.3)
  Top 0.2: IC1.25 16.63,10.41 v16.51,10.29
  Bottom 0.2: v16.51,10.29 16.51,8.13 JP4.2
PA3  (via drill 0.3)
  Top 0.2: IC1.26 18.38,10.51 v18.16,10.29
  Bottom 0.2: v18.16,10.29 18.16,7.24 JP6.1
PA5  (via drill 0.3)
  Top 0.2: IC1.30 20.38,11.75 19.46,10.82 v19.46,10.16
  Bottom 0.2: v19.46,10.16 19.46,7.72 JP6.2
PA6  (via drill 0.3)
  Top 0.2: IC1.31 20.88,11.49 20.32,10.92 v20.32,10
  Bottom 0.2: v20.32,10 20.32,9.91 20.83,9.4 36.45,9.4 JP9.1
PA7  (via drill 0.3)
  Top 0.2: IC1.32 21.38,10.97 v21.08,10.67
  Bottom 0.2: v21.08,10.67 21.08,10.03 21.21,9.91 38.48,9.91 JP9.2
PA13
  Top 0.2: IC1.72 33.58,26.09 34.54,27.05 34.54,28.19 35.43,29.08 43.93,29.08 X7.2
PA14
  Top 0.2: IC1.76 30.76,29.72 X7.3
PA15  (via drill 0.3)
  Top 0.2: IC1.77 29.88,27.73 29.21,27.05 29.21,22.1 28.32,21.21 v28.19,21.21 | v28.19,19.18 v28.19,15.62 | v28.07,12.32 28.07,10.41 30.48,8 JP7.2
  Bottom 0.2: v28.19,21.21 v28.19,19.18 | v28.19,15.62 28.19,12.45 v28.07,12.32
PB0
  Top 0.2: IC1.35 22.88,9.29 22.1,8.51 7.87,8.51 6.73,7.37 ADC2.1
PB1
  Top 0.2: IC1.36 23.38,8.91 22.61,8.13 10.54,8.13 ADC2.2
PB3  (via drill 0.3)
  Top 0.2: IC1.89 v23.88,21.34 | v23.88,19.18 26.54,19.18 26.92,18.8 v26.92,15.75 | v26.8,12.32 26.8,8 JP7.1
  Bottom 0.2: v23.88,21.34 v23.88,19.18 | v26.92,15.75 26.92,12.45 v26.8,12.32
PB4
  Top 0.2: PWMIN.4 20.07,34.04 20.95,34.04 21.59,33.4 21.59,30.73 21.97,30.35 23.24,30.35 23.38,30.21 IC1.90
PB5  (via drill 0.3)
  Top 0.2: IC1.91 22.88,28.09 v22.86,28.07 | v15.62,32.89 5.71,32.89 EXTIN.6
  Bottom 0.2: v22.86,28.07 22.61,28.32 20.19,28.32 v15.62,32.89
PB7  (via drill 0.35)
  Top 0.152: IC1.93 21.88,28.19
  Top 0.2: IC1.93 21.88,27.14 22.73,26.29 v22.73,25.27 | v25.02,25.15 27.3,27.43 v27.69,27.43
  Bottom 0.2: v22.73,25.27 24.89,25.27 v25.02,25.15 | v27.69,27.43 26.67,28.45 26.67,33.53 25.78,34.42 24.77,34.42 23.18,36 22.99,36.2 PWMIN.6
PB10
  Top 0.2: IC1.47 28.88,10.74 29.72,9.91 32.39,9.91 33.02,9.27 JP8.1
PB11
  Top 0.2: IC1.48 29.38,11 29.97,10.41 33.66,10.41 35.56,8.51 JP8.2
PB14
  Top 0.2: IC1.53 34.59,16.59 35.31,15.88 35.31,11.3 36.7,9.91 42.67,9.91 44.07,8.51 JP10.1
PB15
  Top 0.2: IC1.54 32.21,17.02 34.8,17.02 35.81,16 35.81,11.56 36.96,10.41 43.05,10.41 JP10.2
PC4
  Top 0.2: IC1.33 21.88,10.07 21.21,9.4 3.17,9.4 1.65,7.87 ADC.1
PC5
  Top 0.2: IC1.34 22.38,9.68 21.59,8.89 5.33,8.89 4.19,7.75 ADC.2
PC7  (via drill 0.3)
  Top 0.2: IC1.64 v33.66,22.1 | v15.75,34.29 12.19,34.29 PWMIN.1
  Bottom 0.2: v33.66,22.1 31.88,22.1 30.99,21.21 29.97,21.21 27.69,23.5 27.69,24.64 23.37,28.96 20.57,28.96 16.64,32.89 16.64,33.4 v15.75,34.29
PD5
  Top 0.2: IC1.86 25.38,32.12 GY25.3
PD6
  Top 0.2: IC1.87 24.89,30.23 22.99,32.13 GY25.2
PD8  (via drill 0.3)
  Top 0.2: IC1.55 35.24,17.59 36.58,16.26 v36.58,15.37
  Bottom 0.3: SERIAL.2 v36.58,15.37
PD9
  Top 0.2: IC1.56 35.76,18.09 37.59,16.26 SERIAL.1
PD12  (via drill 0.3)
  Top 0.2: IC1.59 30.96,19.59 30.61,19.94 v30.61,22.23
  Bottom 0.2: PWMIN.5 22.48,34.16 23.62,34.16 24.13,33.66 24.13,30.61 26.04,28.7 26.04,27.3 28.57,24.77 28.57,23.75 30.1,22.23 v30.61,22.23
PE5
  Top 0.2: IC1.4 15.69,26.09 14.86,26.92 9.65,26.92 8.64,27.94 8.64,30.48 8,31.12 4.95,31.12 EXTIN.5
PE6  (via drill 0.3)
  Top 0.2: IC1.5 15.18,25.59 v14.99,25.78
  Bottom 0.2: v14.99,25.78 15.24,26.04 16.26,26.04 16.38,26.16 16.38,29.72 13.72,32.38 13.72,35.31 PWMIN.2
PE9
  Top 0.2: IC1.40 25.38,8.62 24.89,8.13 23.75,8.13 22.86,7.24 JP5.1
PE10
  Top 0.2: IC1.41 25.88,8.23 25.4,7.75 JP5.2
R  (via drill 0.3)
  Top 0.2: RESET.1 v35.81,28.07 | v29.34,18.42 29.08,18.67 29.08,19.69 28.83,19.94 19.81,19.94 18.66,21.09 IC1.14
  Bottom 0.2: C7.2 v35.81,28.07 35.81,27.24 R3.1 34.99,26.42 34.99,20.51 32.89,18.42 v29.34,18.42
RX1
  Top 0.2: IC1.69 35.61,24.59 37.59,22.61 TELEMETRI.1
RX3
  Top 0.2: IC1.79 28.88,30.28 33.78,35.18 37.59,35.18 37.72,35.31 GPS.3
SCL  (via drill 0.3)
  Top 0.2: IC1.95 20.88,27.11 v20.07,26.29 | v15.11,24.89 2.79,24.89
  Top 0.3: 2.79,24.89 2.03,25.65 BMP280.3
  Bottom 0.2: v20.07,26.29 19.68,25.91 17.4,25.91 16.38,24.89 v15.11,24.89
SCL3  (via drill 0.3)
  Top 0.2: IC1.67 30.77,23.59 30.61,23.75 v30.61,24.51
  Bottom 0.2: 30.48,24.51 v30.61,24.51
  Bottom 0.25: v30.61,24.51 29.84,25.27 29.84,26.8 30.86,27.81 30.86,30.99 35.18,35.31 GPS.2
SDA  (via drill 0.3)
  Top 0.2: v19.68,25.15 19.43,25.4 19.43,26.8 20.38,27.75 IC1.96 | 2.29,23.88 v15.11,23.88
  Top 0.3: BMP280.4 2.29,23.62 2.29,23.88
  Bottom 0.2: v19.68,25.15 17.91,25.15 16.64,23.88 v15.11,23.88
SDA3  (via drill 0.35)
  Top 0.25: IC1.66 33.76,23.09 v33.91,23.24
  Bottom 0.25: v33.91,23.24 30.35,23.24 29.91,23.69 29.84,23.75 29.21,24.38 29.21,27.05 29.84,27.69 29.84,31.24 30.61,32 30.86,32.26 32.64,34.04 GPS.1
TX1  (via drill 0.3)
  Top 0.2: IC1.68 35.35,24.09 36.7,22.73 v36.7,21.46
  Bottom 0.3: v36.7,21.46 39.37,21.46 40.13,20.7 TELEMETRI.2
TX3
  Top 0.2: IC1.78 29.38,30.02 34.04,34.67 39.62,34.67 40.26,35.31 GPS.4
VCC  (via drill 0.3)
  Top 0.152: IC1.21 18.94,17.59 19.38,18.03
  Top 0.2: C11.1 30.63,13.59 IC1.50 30.38,18.77 29.84,19.3 29.84,20.45 | v14.61,19.05 15.07,18.59 IC1.19 19,18.59 19.38,18.21 19.38,18.03 IC1.28 | v33.15,27.56 33.12,27.59 IC1.75 30.64,27.59 29.84,26.8 29.84,20.45 | v12.56,21.2 13.95,22.59 IC1.11 18.03,22.59 | v2.03,14.86 3V.A | 18.03,22.59 18.68,22.59 20.83,20.45 29.84,20.45 | IC1.100 18.38,24.48 v18.03,24.13 | v18.29,21.84 18.29,22.34 18.03,22.59 | IC1.21 IC1.22
  Bottom 0.2: v14.61,19.05 13.78,19.05 C8.2 13.59,20.83 | v33.15,27.56 33.47,27.56 R3.2 | 13.59,20.83 C16.1 13.38,21.2 v12.56,21.2 | 13.59,20.83 13.36,21.06 IC2.2 7.77,21.06 | C12.1 C13.1 C2.1 9.53,27.56 8,29.08 6.98,29.08 6.35,28.45 5.53,28.45 | 3.81,30.99 5.53,29.27 5.53,28.45 | 5.53,28.45 C10.1 C9.2 5.53,23.67 6.11,23.09 6.11,22.72 7.77,21.06 | 7.77,21.06 6.35,19.63 6.35,19.18 5.59,18.42 4.7,18.42 3.56,17.27 3.56,16.38 v2.03,14.86 | v18.03,24.13 18.03,22.1 v18.29,21.84
  Bottom 0.3: 3.81,30.99 BMP280.1
(copper drawn outside any net)
  shapes: Top area x2

### Text on the board
tNames: ADC | PWM OUT | EXT OUT | EXT OUT
bNames: fahmi mashuri | GND | PC7 | PE6 | PA0 | PB4 | PD12 | PB7 | 5V | GND | SDA | SCL | RX3 | TX3 | 5V | GND | 5V | PC9 | PA8 | PC11 | PC10 | PE5 | PB5 | RX1 | TX1 | 5V | GND | PA10 | PA9 | PD9 | PD8 | 5V | GND | PC4 | PC5 | PB0 | PB1 | PA1 | PA2 | PA3 | PA5 | PE9 | PE10 | PB3 | PA15 | PB10 | PB11 | PA6 | PA7 | PB14 | PB15